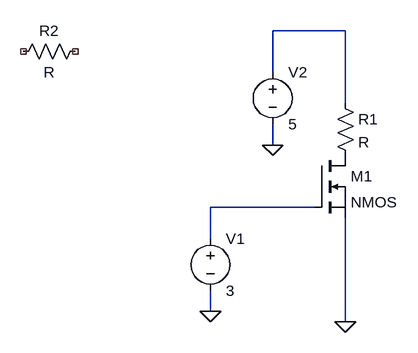
[diagram p0: schematic MOSFET gate driver NPN.asc]
MOSFET gate driver NPN.asc, the LTspice schematic file:
Version 4
SHEET 1 880 680
WIRE 192 -48 80 -48
WIRE 80 16 80 -48
WIRE 192 64 192 -48
WIRE 80 128 80 96
WIRE 144 224 -16 224
WIRE -16 272 -16 224
WIRE -16 384 -16 352
WIRE 192 400 192 240
FLAG 192 400 0
FLAG 80 128 0
FLAG -16 384 0
SYMBOL res 176 48 R0
SYMATTR InstName R1
SYMBOL res -208 -32 R90
WINDOW 0 0 56 VBottom 2
WINDOW 3 32 56 VTop 2
SYMATTR InstName R2
SYMBOL nmos 144 144 R0
SYMATTR InstName M1
SYMBOL voltage -16 256 R0
WINDOW 123 0 0 Left 0
WINDOW 39 0 0 Left 0
SYMATTR InstName V1
SYMATTR Value 3
SYMBOL voltage 80 0 R0
WINDOW 123 0 0 Left 0
WINDOW 39 0 0 Left 0
SYMATTR InstName V2
SYMATTR Value 5

The netlist it stands for:
* MOSFET gate driver NPN.asc
R1 N001 P001 R
R2 NC_01 NC_02 R
M1 P001 N002 0 0 NMOS
V1 N002 0 3
V2 N001 0 5
.model NMOS NMOS
.model PMOS PMOS
.lib standard.mos
.backanno
.end